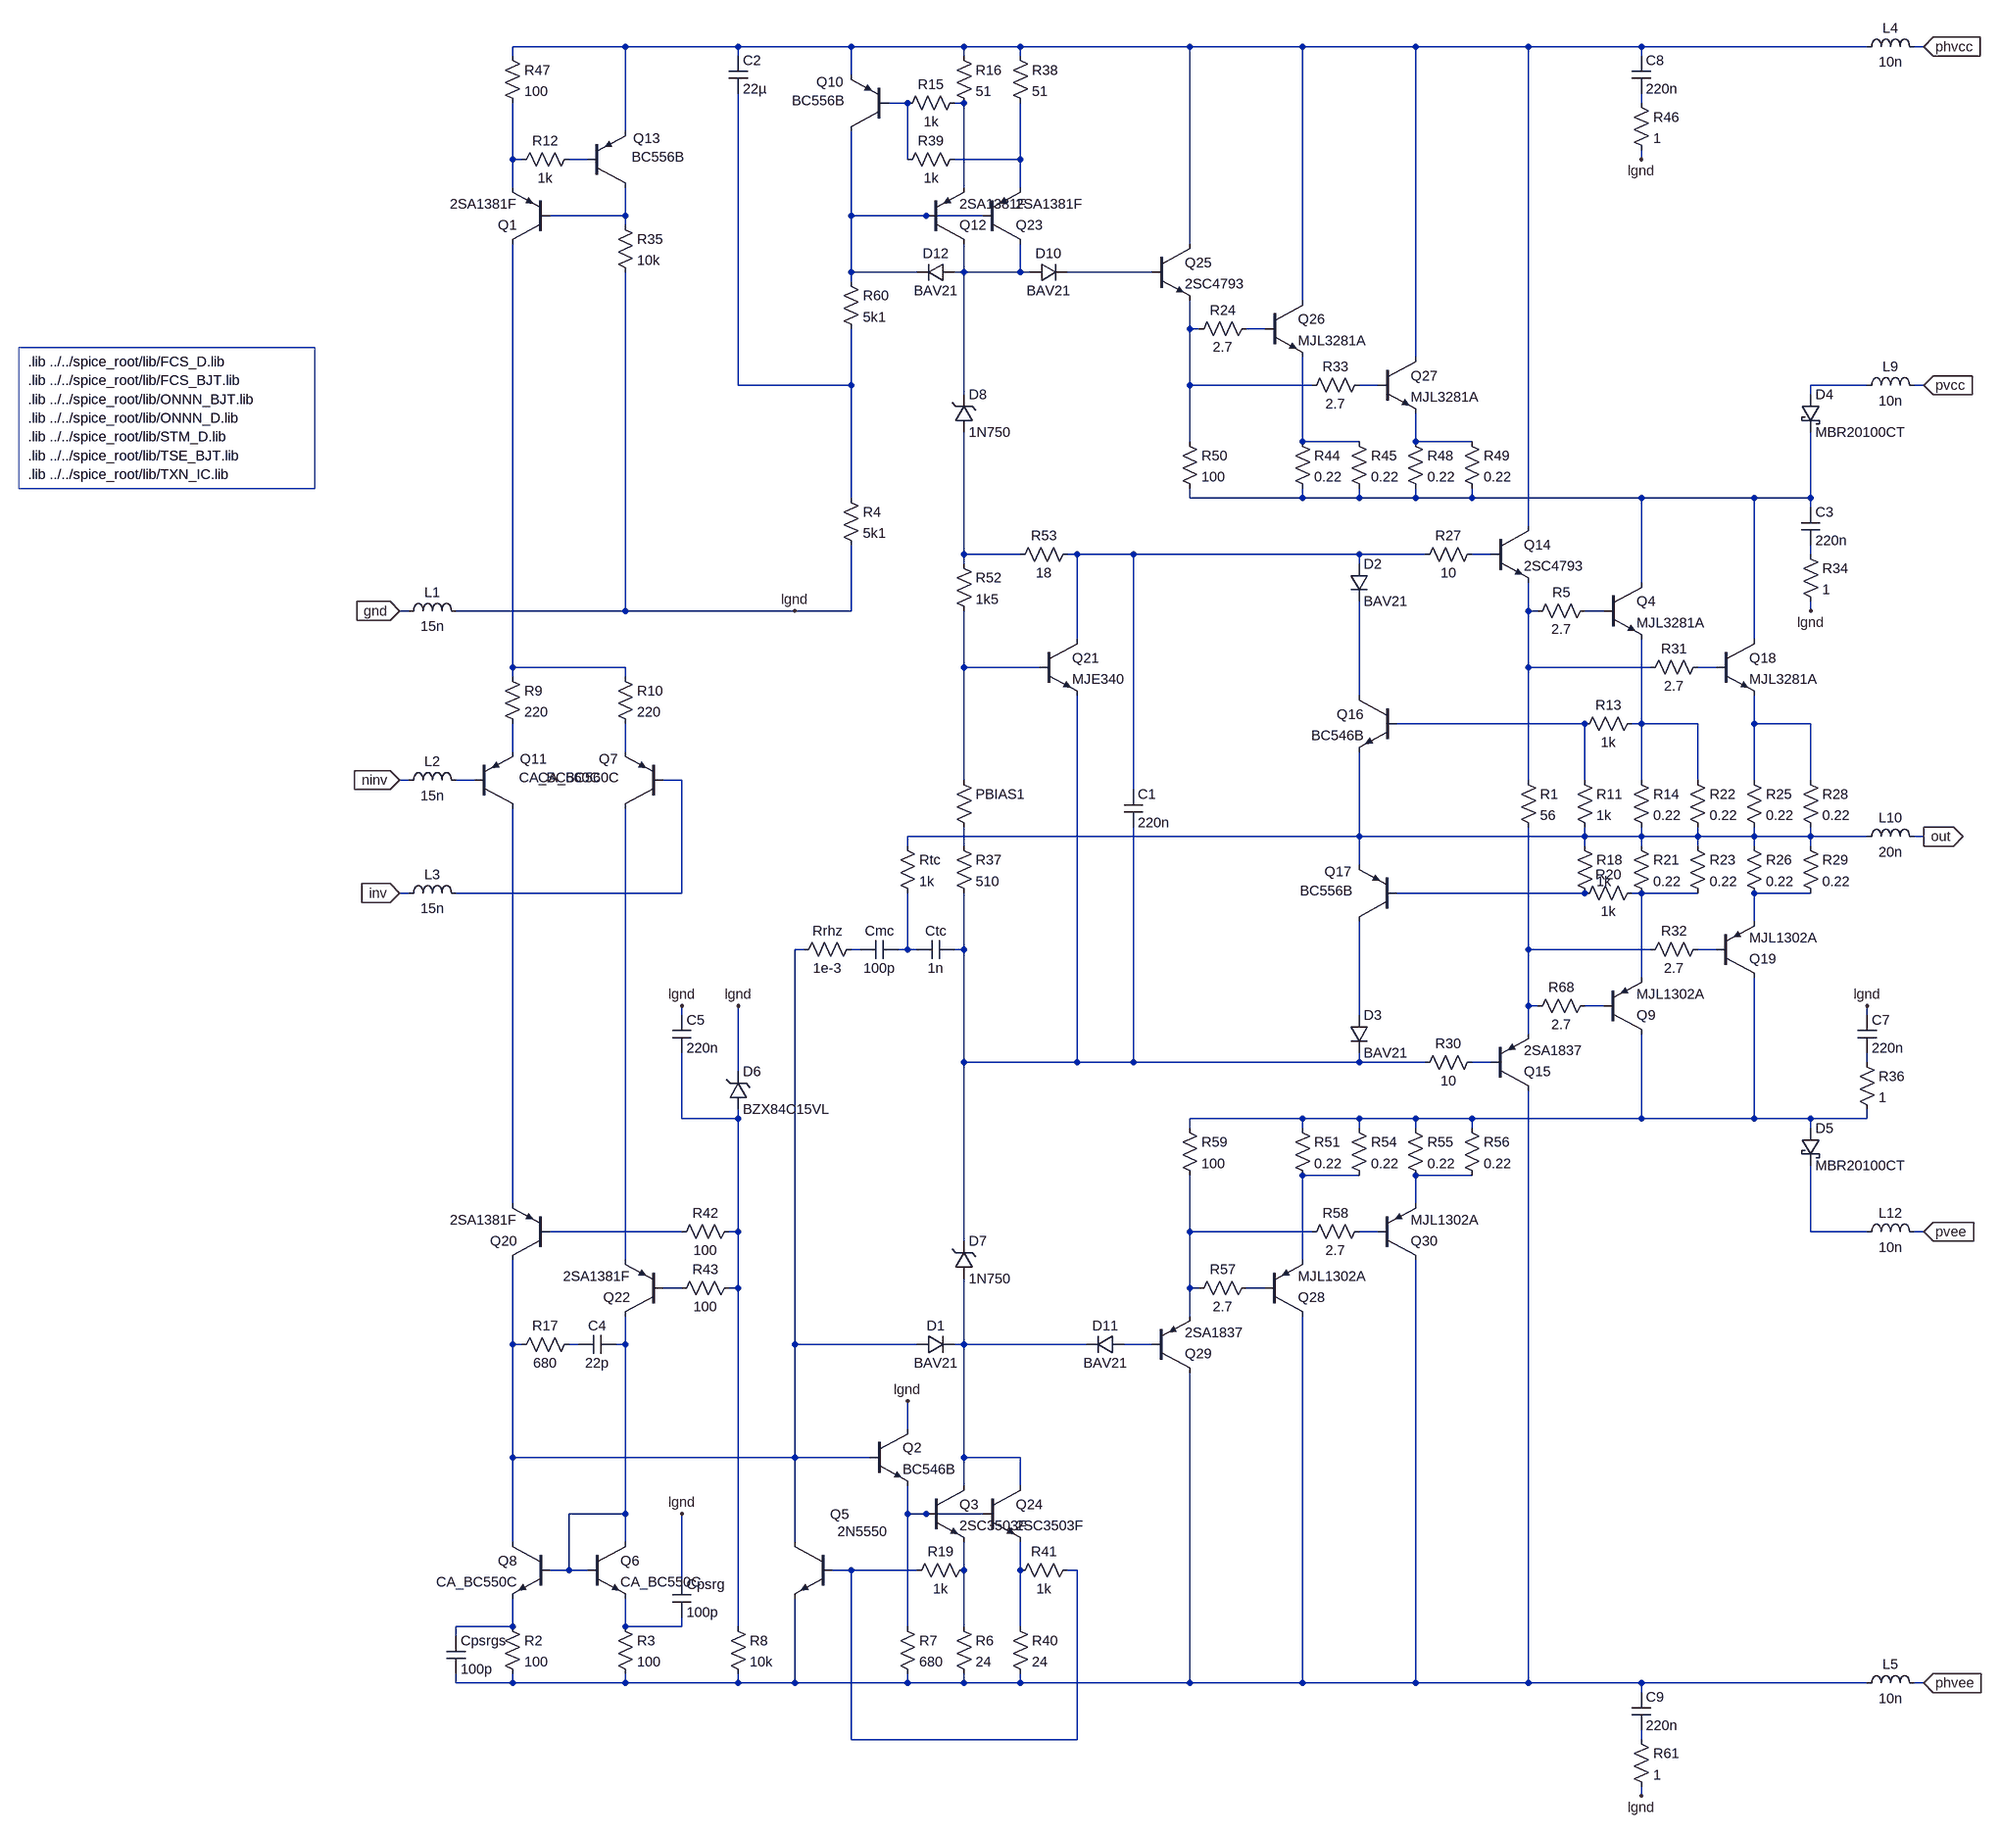
[diagram p0: schematic pab3bbb-arguo-module-hpw.asc]
pab3bbb-arguo-module-hpw.asc, the LTspice schematic file:
Version 4
SHEET 1 6124 2336
WIRE 192 -1568 0 -1568
WIRE 384 -1568 192 -1568
WIRE 576 -1568 384 -1568
WIRE 768 -1568 576 -1568
WIRE 864 -1568 768 -1568
WIRE 1152 -1568 864 -1568
WIRE 1344 -1568 1152 -1568
WIRE 1536 -1568 1344 -1568
WIRE 1728 -1568 1536 -1568
WIRE 1920 -1568 1728 -1568
WIRE 2304 -1568 1920 -1568
WIRE 2400 -1568 2384 -1568
WIRE 0 -1552 0 -1568
WIRE 384 -1552 384 -1568
WIRE 768 -1552 768 -1568
WIRE 864 -1552 864 -1568
WIRE 1920 -1552 1920 -1568
WIRE 576 -1520 576 -1568
WIRE 672 -1472 640 -1472
WIRE 768 -1472 752 -1472
WIRE 1920 -1472 1920 -1488
WIRE 192 -1424 192 -1568
WIRE 0 -1376 0 -1472
WIRE 16 -1376 0 -1376
WIRE 128 -1376 96 -1376
WIRE 672 -1376 672 -1472
WIRE 864 -1376 864 -1472
WIRE 864 -1376 752 -1376
WIRE 1920 -1376 1920 -1392
WIRE 0 -1328 0 -1376
WIRE 768 -1328 768 -1472
WIRE 864 -1328 864 -1376
WIRE 192 -1280 192 -1328
WIRE 192 -1280 64 -1280
WIRE 576 -1280 576 -1424
WIRE 704 -1280 576 -1280
WIRE 800 -1280 704 -1280
WIRE 192 -1264 192 -1280
WIRE 1152 -1232 1152 -1568
WIRE 576 -1184 576 -1280
WIRE 688 -1184 576 -1184
WIRE 768 -1184 768 -1232
WIRE 768 -1184 752 -1184
WIRE 864 -1184 864 -1232
WIRE 864 -1184 768 -1184
WIRE 880 -1184 864 -1184
WIRE 1088 -1184 944 -1184
WIRE 576 -1168 576 -1184
WIRE 1344 -1136 1344 -1568
WIRE 1152 -1088 1152 -1136
WIRE 1168 -1088 1152 -1088
WIRE 1280 -1088 1248 -1088
WIRE 1536 -1040 1536 -1568
WIRE 384 -992 384 -1488
WIRE 576 -992 576 -1088
WIRE 576 -992 384 -992
WIRE 1152 -992 1152 -1088
WIRE 1360 -992 1152 -992
WIRE 1472 -992 1440 -992
WIRE 2304 -992 2208 -992
WIRE 2400 -992 2384 -992
WIRE 768 -976 768 -1184
WIRE 2208 -976 2208 -992
WIRE 1152 -896 1152 -992
WIRE 1344 -896 1344 -1040
WIRE 1440 -896 1344 -896
WIRE 1536 -896 1536 -944
WIRE 1632 -896 1536 -896
WIRE 576 -800 576 -992
WIRE 1152 -800 1152 -816
WIRE 1344 -800 1344 -816
WIRE 1344 -800 1152 -800
WIRE 1440 -800 1440 -816
WIRE 1440 -800 1344 -800
WIRE 1536 -800 1536 -816
WIRE 1536 -800 1440 -800
WIRE 1632 -800 1632 -816
WIRE 1632 -800 1536 -800
WIRE 1920 -800 1632 -800
WIRE 2112 -800 1920 -800
WIRE 2208 -800 2208 -912
WIRE 2208 -800 2112 -800
WIRE 2208 -784 2208 -800
WIRE 1728 -752 1728 -1568
WIRE 768 -704 768 -912
WIRE 864 -704 768 -704
WIRE 960 -704 944 -704
WIRE 1056 -704 960 -704
WIRE 1440 -704 1056 -704
WIRE 1552 -704 1440 -704
WIRE 1664 -704 1632 -704
WIRE 2208 -704 2208 -720
WIRE 768 -688 768 -704
WIRE 1440 -688 1440 -704
WIRE 1920 -656 1920 -800
WIRE -176 -608 -192 -608
WIRE 192 -608 192 -1184
WIRE 192 -608 -96 -608
WIRE 480 -608 192 -608
WIRE 576 -608 576 -720
WIRE 576 -608 480 -608
WIRE 1728 -608 1728 -656
WIRE 1744 -608 1728 -608
WIRE 1856 -608 1824 -608
WIRE 2208 -608 2208 -624
WIRE 960 -560 960 -704
WIRE 2112 -560 2112 -800
WIRE 0 -512 0 -1232
WIRE 192 -512 0 -512
WIRE 768 -512 768 -608
WIRE 896 -512 768 -512
WIRE 1728 -512 1728 -608
WIRE 1936 -512 1728 -512
WIRE 2048 -512 2016 -512
WIRE 0 -496 0 -512
WIRE 192 -496 192 -512
WIRE 1440 -464 1440 -624
WIRE 1824 -416 1504 -416
WIRE 1920 -416 1920 -560
WIRE 1920 -416 1904 -416
WIRE 2016 -416 1920 -416
WIRE 2112 -416 2112 -464
WIRE 2208 -416 2112 -416
WIRE 0 -368 0 -416
WIRE 192 -368 192 -416
WIRE -176 -320 -192 -320
WIRE -64 -320 -96 -320
WIRE 288 -320 256 -320
WIRE 768 -320 768 -512
WIRE 1728 -320 1728 -512
WIRE 1824 -320 1824 -416
WIRE 1920 -320 1920 -416
WIRE 2016 -320 2016 -416
WIRE 2112 -320 2112 -416
WIRE 2208 -320 2208 -416
WIRE 1056 -304 1056 -704
WIRE 1440 -224 1440 -368
WIRE 1440 -224 672 -224
WIRE 1824 -224 1824 -240
WIRE 1824 -224 1440 -224
WIRE 1920 -224 1920 -240
WIRE 1920 -224 1824 -224
WIRE 2016 -224 2016 -240
WIRE 2016 -224 1920 -224
WIRE 2112 -224 2112 -240
WIRE 2112 -224 2016 -224
WIRE 2208 -224 2208 -240
WIRE 2208 -224 2112 -224
WIRE 2304 -224 2208 -224
WIRE 2400 -224 2384 -224
WIRE 672 -208 672 -224
WIRE 768 -208 768 -240
WIRE 1824 -208 1824 -224
WIRE 1920 -208 1920 -224
WIRE 2016 -208 2016 -224
WIRE 2112 -208 2112 -224
WIRE 2208 -208 2208 -224
WIRE 1440 -176 1440 -224
WIRE -176 -128 -192 -128
WIRE 288 -128 288 -320
WIRE 288 -128 -96 -128
WIRE 1824 -128 1504 -128
WIRE 1920 -128 1904 -128
WIRE 2016 -128 1920 -128
WIRE 2208 -128 2112 -128
WIRE 2112 -80 2112 -128
WIRE 496 -32 480 -32
WIRE 592 -32 576 -32
WIRE 672 -32 672 -128
WIRE 672 -32 656 -32
WIRE 688 -32 672 -32
WIRE 768 -32 768 -128
WIRE 768 -32 752 -32
WIRE 1728 -32 1728 -240
WIRE 1936 -32 1728 -32
WIRE 2048 -32 2016 -32
WIRE 1920 16 1920 -128
WIRE 1728 64 1728 -32
WIRE 1744 64 1728 64
WIRE 1856 64 1824 64
WIRE 288 80 288 64
WIRE 1440 80 1440 -80
WIRE 2304 80 2304 64
WIRE 1728 112 1728 64
WIRE 768 160 768 -32
WIRE 960 160 960 -464
WIRE 960 160 768 160
WIRE 1056 160 1056 -240
WIRE 1056 160 960 160
WIRE 1440 160 1440 144
WIRE 1440 160 1056 160
WIRE 1552 160 1440 160
WIRE 1664 160 1632 160
WIRE 2304 160 2304 144
WIRE 384 176 384 64
WIRE 288 256 288 144
WIRE 384 256 384 240
WIRE 384 256 288 256
WIRE 1344 256 1152 256
WIRE 1440 256 1344 256
WIRE 1536 256 1440 256
WIRE 1632 256 1536 256
WIRE 1920 256 1920 112
WIRE 1920 256 1632 256
WIRE 2112 256 2112 16
WIRE 2112 256 1920 256
WIRE 2208 256 2112 256
WIRE 2304 256 2304 240
WIRE 2304 256 2208 256
WIRE 1152 272 1152 256
WIRE 1344 272 1344 256
WIRE 1440 272 1440 256
WIRE 1536 272 1536 256
WIRE 1632 272 1632 256
WIRE 2208 272 2208 256
WIRE 1440 352 1344 352
WIRE 1632 352 1536 352
WIRE 0 400 0 -272
WIRE 1536 400 1536 352
WIRE 288 448 64 448
WIRE 384 448 384 256
WIRE 384 448 368 448
WIRE 1152 448 1152 352
WIRE 1360 448 1152 448
WIRE 1472 448 1440 448
WIRE 2208 448 2208 336
WIRE 2304 448 2208 448
WIRE 2400 448 2384 448
WIRE 768 464 768 160
WIRE 192 496 192 -272
WIRE 1344 496 1344 352
WIRE 288 544 256 544
WIRE 384 544 384 448
WIRE 384 544 368 544
WIRE 1152 544 1152 448
WIRE 1168 544 1152 544
WIRE 1280 544 1248 544
WIRE 1152 592 1152 544
WIRE 0 640 0 496
WIRE 16 640 0 640
WIRE 112 640 96 640
WIRE 192 640 192 592
WIRE 192 640 176 640
WIRE 480 640 480 -32
WIRE 688 640 480 640
WIRE 768 640 768 528
WIRE 768 640 752 640
WIRE 976 640 768 640
WIRE 1088 640 1040 640
WIRE 672 784 672 736
WIRE 0 832 0 640
WIRE 480 832 480 640
WIRE 480 832 0 832
WIRE 608 832 480 832
WIRE 768 832 768 640
WIRE 864 832 768 832
WIRE 768 880 768 832
WIRE 864 880 864 832
WIRE 192 928 192 640
WIRE 192 928 96 928
WIRE 672 928 672 880
WIRE 704 928 672 928
WIRE 800 928 704 928
WIRE 0 976 0 832
WIRE 192 976 192 928
WIRE 480 976 480 832
WIRE 96 1024 96 928
WIRE 96 1024 64 1024
WIRE 128 1024 96 1024
WIRE 576 1024 544 1024
WIRE 688 1024 576 1024
WIRE 768 1024 768 976
WIRE 864 1024 864 976
WIRE 960 1024 944 1024
WIRE 288 1040 288 928
WIRE 0 1120 0 1072
WIRE 0 1120 -96 1120
WIRE 192 1120 192 1072
WIRE 288 1120 288 1104
WIRE 288 1120 192 1120
WIRE 384 1120 384 544
WIRE 672 1120 672 928
WIRE 768 1120 768 1024
WIRE 864 1120 864 1024
WIRE -96 1136 -96 1120
WIRE -96 1216 -96 1200
WIRE 0 1216 0 1200
WIRE 0 1216 -96 1216
WIRE 192 1216 192 1200
WIRE 192 1216 0 1216
WIRE 384 1216 384 1200
WIRE 384 1216 192 1216
WIRE 480 1216 480 1072
WIRE 480 1216 384 1216
WIRE 672 1216 672 1200
WIRE 672 1216 480 1216
WIRE 768 1216 768 1200
WIRE 768 1216 672 1216
WIRE 864 1216 864 1200
WIRE 864 1216 768 1216
WIRE 1152 1216 1152 688
WIRE 1152 1216 864 1216
WIRE 1344 1216 1344 592
WIRE 1344 1216 1152 1216
WIRE 1536 1216 1536 496
WIRE 1536 1216 1344 1216
WIRE 1728 1216 1728 208
WIRE 1728 1216 1536 1216
WIRE 1920 1216 1728 1216
WIRE 2304 1216 1920 1216
WIRE 2400 1216 2384 1216
WIRE 1920 1232 1920 1216
WIRE 576 1312 576 1024
WIRE 960 1312 960 1024
WIRE 960 1312 576 1312
WIRE 1920 1312 1920 1296
WIRE 1920 1408 1920 1392
FLAG 2400 -992 pvcc
IOPIN 2400 -992 In
FLAG 2400 448 pvee
IOPIN 2400 448 In
FLAG 2400 -224 out
IOPIN 2400 -224 Out
FLAG -192 -320 ninv
IOPIN -192 -320 In
FLAG -192 -128 inv
IOPIN -192 -128 In
FLAG -192 -608 gnd
IOPIN -192 -608 In
FLAG 2400 -1568 phvcc
IOPIN 2400 -1568 In
FLAG 480 -608 lgnd
FLAG 2304 64 lgnd
FLAG 2208 -608 lgnd
FLAG 288 928 lgnd
FLAG 672 736 lgnd
FLAG 384 64 lgnd
FLAG 288 64 lgnd
FLAG 1920 -1376 lgnd
FLAG 1920 1408 lgnd
FLAG 2400 1216 phvee
IOPIN 2400 1216 In
SYMBOL pnp -64 -272 M180
WINDOW 0 77 84 Left 2
WINDOW 3 75 52 Left 2
SYMATTR InstName Q11
SYMATTR Value CA_BC560C
SYMBOL res -16 1104 R0
SYMATTR InstName R2
SYMATTR Value 100
SYMBOL res 176 1104 R0
SYMATTR InstName R3
SYMATTR Value 100
SYMBOL res -16 -512 R0
SYMATTR InstName R9
SYMATTR Value 220
SYMBOL res 176 -512 R0
SYMATTR InstName R10
SYMATTR Value 220
SYMBOL res 752 -1568 R0
SYMATTR InstName R16
SYMATTR Value 51
SYMBOL pnp 704 -1232 M180
SYMATTR InstName Q12
SYMATTR Value 2SA1381F
SYMBOL res 1648 -720 R90
WINDOW 0 0 56 VBottom 2
WINDOW 3 32 56 VTop 2
SYMATTR InstName R27
SYMATTR Value 10
SYMBOL res 1648 144 R90
WINDOW 0 0 56 VBottom 2
WINDOW 3 32 56 VTop 2
SYMATTR InstName R30
SYMATTR Value 10
SYMBOL res -16 -1568 R0
SYMATTR InstName R47
SYMATTR Value 100
SYMBOL res 752 -336 R0
WINDOW 3 36 76 Invisible 2
SYMATTR Value {1+(500*BIAS)}
SYMATTR InstName PBIAS1
SYMBOL res 752 -704 R0
SYMATTR InstName R52
SYMATTR Value 1k5
SYMBOL res 960 -720 R90
WINDOW 0 0 56 VBottom 2
WINDOW 3 32 56 VTop 2
SYMATTR InstName R53
SYMATTR Value 18
SYMBOL npn 704 880 R0
SYMATTR InstName Q3
SYMATTR Value 2SC3503F
SYMBOL res 752 1104 R0
SYMATTR InstName R6
SYMATTR Value 24
SYMBOL res 560 -816 R0
SYMATTR InstName R4
SYMATTR Value 5k1
SYMBOL pnp 64 -1232 R180
SYMATTR InstName Q1
SYMATTR Value 2SA1381F
SYMBOL pnp 256 -272 R180
WINDOW 0 77 84 Left 2
WINDOW 3 75 52 Left 2
SYMATTR InstName Q7
SYMATTR Value CA_BC560C
SYMBOL npn 896 -560 R0
SYMATTR InstName Q21
SYMATTR Value MJE340
SYMBOL res 752 -224 R0
SYMATTR InstName R37
SYMATTR Value 510
SYMBOL npn 1856 -656 R0
SYMATTR InstName Q4
SYMATTR Value MJL3281A
SYMBOL pnp 1856 112 M180
SYMATTR InstName Q9
SYMATTR Value MJL1302A
SYMBOL res 1840 -624 R90
WINDOW 0 0 56 VBottom 2
WINDOW 3 32 56 VTop 2
SYMATTR InstName R5
SYMATTR Value 2.7
SYMBOL res 1840 48 R90
WINDOW 0 0 56 VBottom 2
WINDOW 3 32 56 VTop 2
SYMATTR InstName R68
SYMATTR Value 2.7
SYMBOL cap 656 -48 R90
WINDOW 0 0 32 VBottom 2
WINDOW 3 32 32 VTop 2
SYMATTR InstName Cmc
SYMATTR Value 100p
SYMATTR SpiceLine V=100 Irms=20.8m Rser=5.448 Lser=3n Rpar=6.4meg Cpar=1p
SYMBOL npn 128 976 R0
SYMATTR InstName Q6
SYMATTR Value CA_BC550C
SYMBOL npn 64 976 M0
SYMATTR InstName Q8
SYMATTR Value CA_BC550C
SYMBOL res 768 -1488 R90
WINDOW 0 0 56 VBottom 2
WINDOW 3 32 56 VTop 2
SYMATTR InstName R15
SYMATTR Value 1k
SYMBOL npn 608 784 R0
SYMATTR InstName Q2
SYMATTR Value BC546B
SYMBOL res 656 1104 R0
SYMATTR InstName R7
SYMATTR Value 680
SYMBOL cap 752 -48 R90
WINDOW 0 0 32 VBottom 2
WINDOW 3 32 32 VTop 2
SYMATTR InstName Ctc
SYMATTR Value 1n
SYMATTR SpiceLine V=100 Irms=75.3m Rser=2.89088 Lser=3n Rpar=4.4meg Cpar=1p
SYMBOL res 656 -224 R0
SYMATTR InstName Rtc
SYMATTR Value 1k
SYMBOL diode 688 656 R270
WINDOW 0 32 32 VTop 2
WINDOW 3 0 32 VBottom 2
SYMATTR InstName D1
SYMATTR Value BAV21
SYMBOL pnp 640 -1424 R180
WINDOW 0 77 84 Left 2
WINDOW 3 75 52 Left 2
SYMATTR InstName Q10
SYMATTR Value BC556B
SYMBOL res 1904 -336 R0
SYMATTR InstName R14
SYMATTR Value 0.22
SYMBOL res 1904 -224 R0
SYMATTR InstName R21
SYMATTR Value 0.22
SYMBOL res 176 -1280 R0
SYMATTR InstName R35
SYMATTR Value 10k
SYMBOL cap 1040 -240 M180
WINDOW 0 24 56 Left 2
WINDOW 3 24 8 Left 2
SYMATTR InstName C1
SYMATTR Value 220n
SYMATTR SpiceLine V=25 Irms=1.76 Rser=0.057522 Lser=3n Rpar=4.4meg Cpar=1p
SYMBOL ind -192 -592 R270
WINDOW 0 32 56 VTop 2
WINDOW 3 5 56 VBottom 2
SYMATTR InstName L1
SYMATTR Value 15n
SYMATTR SpiceLine Rser=20m
SYMBOL ind -192 -304 R270
WINDOW 0 32 56 VTop 2
WINDOW 3 5 56 VBottom 2
SYMATTR InstName L2
SYMATTR Value 15n
SYMATTR SpiceLine Rser=20m
SYMBOL ind -192 -112 R270
WINDOW 0 32 56 VTop 2
WINDOW 3 5 56 VBottom 2
SYMATTR InstName L3
SYMATTR Value 15n
SYMATTR SpiceLine Rser=20m
SYMBOL ind 2288 -208 R270
WINDOW 0 32 56 VTop 2
WINDOW 3 5 56 VBottom 2
SYMATTR InstName L10
SYMATTR Value 20n
SYMATTR SpiceLine Rser=10m
SYMBOL ind 2288 -976 R270
WINDOW 0 32 56 VTop 2
WINDOW 3 5 56 VBottom 2
SYMATTR InstName L9
SYMATTR Value 10n
SYMATTR SpiceLine Rser=10m
SYMBOL ind 2288 464 R270
WINDOW 0 32 56 VTop 2
WINDOW 3 5 56 VBottom 2
SYMATTR InstName L12
SYMATTR Value 10n
SYMATTR SpiceLine Rser=10m
SYMBOL cap 112 656 R270
WINDOW 0 32 32 VTop 2
WINDOW 3 0 32 VBottom 2
SYMATTR InstName C4
SYMATTR Value 22p
SYMATTR SpiceLine V=100 Irms=20.8m Rser=15.448 Lser=3n Rpar=6.4meg Cpar=1p
SYMBOL res 112 624 R90
WINDOW 0 0 56 VBottom 2
WINDOW 3 32 56 VTop 2
SYMATTR InstName R17
SYMATTR Value 680
SYMBOL pnp 128 -1328 M180
WINDOW 0 77 84 Left 2
WINDOW 3 75 52 Left 2
SYMATTR InstName Q13
SYMATTR Value BC556B
SYMBOL res 112 -1392 R90
WINDOW 0 0 56 VBottom 2
WINDOW 3 32 56 VTop 2
SYMATTR InstName R12
SYMATTR Value 1k
SYMBOL npn 1664 -752 R0
SYMATTR InstName Q14
SYMATTR Value 2SC4793
SYMBOL pnp 1664 208 M180
SYMATTR InstName Q15
SYMATTR Value 2SA1837
SYMBOL res 1712 -336 R0
SYMATTR InstName R1
SYMATTR Value 56
SYMBOL npn 544 976 M0
WINDOW 0 -29 -47 Left 2
WINDOW 3 -94 -18 Left 2
SYMATTR InstName Q5
SYMATTR Value 2N5550
SYMBOL res 784 1008 R90
WINDOW 0 0 56 VBottom 2
WINDOW 3 32 56 VTop 2
SYMATTR InstName R19
SYMATTR Value 1k
SYMBOL cap -112 1136 R0
SYMATTR InstName Cpsrgs
SYMATTR Value 100p
SYMATTR SpiceLine V=100 Irms=20.8m Rser=5.448 Lser=3n Rpar=6.4meg Cpar=1p
SYMBOL cap 272 1040 R0
SYMATTR InstName Cpsrg
SYMATTR Value 100p
SYMATTR SpiceLine V=100 Irms=20.8m Rser=5.448 Lser=3n Rpar=6.4meg Cpar=1p
SYMBOL npn 1504 -464 M0
SYMATTR InstName Q16
SYMATTR Value BC546B
SYMBOL diode 1424 -688 R0
SYMATTR InstName D2
SYMATTR Value BAV21
SYMBOL res 1808 -336 R0
SYMATTR InstName R11
SYMATTR Value 1k
SYMBOL res 1920 -432 R90
WINDOW 0 0 56 VBottom 2
WINDOW 3 32 56 VTop 2
SYMATTR InstName R13
SYMATTR Value 1k
SYMBOL pnp 1504 -80 R180
WINDOW 0 77 84 Left 2
WINDOW 3 75 52 Left 2
SYMATTR InstName Q17
SYMATTR Value BC556B
SYMBOL res 1808 -224 R0
SYMATTR InstName R18
SYMATTR Value 1k
SYMBOL res 1920 -144 R90
WINDOW 0 0 56 VBottom 2
WINDOW 3 32 56 VTop 2
SYMATTR InstName R20
SYMATTR Value 1k
SYMBOL diode 1424 80 R0
SYMATTR InstName D3
SYMATTR Value BAV21
SYMBOL res 2000 -336 R0
SYMATTR InstName R22
SYMATTR Value 0.22
SYMBOL res 2000 -224 R0
SYMATTR InstName R23
SYMATTR Value 0.22
SYMBOL res 592 -48 R90
WINDOW 0 0 56 VBottom 2
WINDOW 3 32 56 VTop 2
SYMATTR InstName Rrhz
SYMATTR Value 1e-3
SYMBOL res 2096 -336 R0
SYMATTR InstName R25
SYMATTR Value 0.22
SYMBOL res 2096 -224 R0
SYMATTR InstName R26
SYMATTR Value 0.22
SYMBOL res 2192 -336 R0
SYMATTR InstName R28
SYMATTR Value 0.22
SYMBOL res 2192 -224 R0
SYMATTR InstName R29
SYMATTR Value 0.22
SYMBOL npn 2048 -560 R0
SYMATTR InstName Q18
SYMATTR Value MJL3281A
SYMBOL res 2032 -528 R90
WINDOW 0 0 56 VBottom 2
WINDOW 3 32 56 VTop 2
SYMATTR InstName R31
SYMATTR Value 2.7
SYMBOL pnp 2048 16 M180
SYMATTR InstName Q19
SYMATTR Value MJL1302A
SYMBOL res 2032 -48 R90
WINDOW 0 0 56 VBottom 2
WINDOW 3 32 56 VTop 2
SYMATTR InstName R32
SYMATTR Value 2.7
SYMBOL ind 2288 -1552 R270
WINDOW 0 32 56 VTop 2
WINDOW 3 5 56 VBottom 2
SYMATTR InstName L4
SYMATTR Value 10n
SYMATTR SpiceLine Rser=10m
SYMBOL schottky 2192 -976 R0
SYMATTR InstName D4
SYMATTR Value MBR20100CT
SYMATTR Description Diode
SYMATTR Type diode
SYMBOL res 2192 -720 R0
SYMATTR InstName R34
SYMATTR Value 1
SYMBOL cap 2192 -720 M180
WINDOW 0 24 56 Left 2
WINDOW 3 24 8 Left 2
SYMATTR InstName C3
SYMATTR Value 220n
SYMATTR SpiceLine V=25 Irms=1.76 Rser=0.057522 Lser=3n Rpar=4.4meg Cpar=1p
SYMBOL schottky 2192 272 R0
SYMATTR InstName D5
SYMATTR Value MBR20100CT
SYMATTR Description Diode
SYMATTR Type diode
SYMBOL res 2288 144 R0
SYMATTR InstName R36
SYMATTR Value 1
SYMBOL cap 2288 144 M180
WINDOW 0 24 56 Left 2
WINDOW 3 24 8 Left 2
SYMATTR InstName C7
SYMATTR Value 220n
SYMATTR SpiceLine V=25 Irms=1.76 Rser=0.057522 Lser=3n Rpar=4.4meg Cpar=1p
SYMBOL pnp 64 496 R180
SYMATTR InstName Q20
SYMATTR Value 2SA1381F
SYMBOL pnp 256 592 R180
SYMATTR InstName Q22
SYMATTR Value 2SA1381F
SYMBOL zener 368 240 M180
WINDOW 0 24 64 Left 2
WINDOW 3 24 0 Left 2
SYMATTR InstName D6
SYMATTR Value BZX84C15VL
SYMATTR Description Diode
SYMATTR Type diode
SYMBOL res 368 1104 R0
SYMATTR InstName R8
SYMATTR Value 10k
SYMBOL res 848 -1568 R0
SYMATTR InstName R38
SYMATTR Value 51
SYMBOL pnp 800 -1232 M180
SYMATTR InstName Q23
SYMATTR Value 2SA1381F
SYMBOL res 768 -1392 R90
WINDOW 0 0 56 VBottom 2
WINDOW 3 32 56 VTop 2
SYMATTR InstName R39
SYMATTR Value 1k
SYMBOL npn 800 880 R0
SYMATTR InstName Q24
SYMATTR Value 2SC3503F
SYMBOL res 848 1104 R0
SYMATTR InstName R40
SYMATTR Value 24
SYMBOL res 960 1008 R90
WINDOW 0 0 56 VBottom 2
WINDOW 3 32 56 VTop 2
SYMATTR InstName R41
SYMATTR Value 1k
SYMBOL cap 272 144 M180
WINDOW 0 24 56 Left 2
WINDOW 3 24 8 Left 2
SYMATTR InstName C5
SYMATTR Value 220n
SYMATTR SpiceLine V=25 Irms=1.76 Rser=0.057522 Lser=3n Rpar=4.4meg Cpar=1p
SYMBOL res 384 432 R90
WINDOW 0 0 56 VBottom 2
WINDOW 3 32 56 VTop 2
SYMATTR InstName R42
SYMATTR Value 100
SYMBOL res 384 528 R90
WINDOW 0 0 56 VBottom 2
WINDOW 3 32 56 VTop 2
SYMATTR InstName R43
SYMATTR Value 100
SYMBOL res 1904 -1488 R0
SYMATTR InstName R46
SYMATTR Value 1
SYMBOL cap 1904 -1488 M180
WINDOW 0 24 56 Left 2
WINDOW 3 24 8 Left 2
SYMATTR InstName C8
SYMATTR Value 220n
SYMATTR SpiceLine V=25 Irms=1.76 Rser=0.057522 Lser=3n Rpar=4.4meg Cpar=1p
SYMBOL res 1904 1296 R0
SYMATTR InstName R61
SYMATTR Value 1
SYMBOL cap 1904 1296 M180
WINDOW 0 24 56 Left 2
WINDOW 3 24 8 Left 2
SYMATTR InstName C9
SYMATTR Value 220n
SYMATTR SpiceLine V=25 Irms=1.76 Rser=0.057522 Lser=3n Rpar=4.4meg Cpar=1p
SYMBOL ind 2288 1232 R270
WINDOW 0 32 56 VTop 2
WINDOW 3 5 56 VBottom 2
SYMATTR InstName L5
SYMATTR Value 10n
SYMATTR SpiceLine Rser=10m
SYMBOL zener 752 -912 M180
WINDOW 0 24 64 Left 2
WINDOW 3 24 0 Left 2
SYMATTR InstName D8
SYMATTR Value 1N750
SYMATTR Description Diode
SYMATTR Type diode
SYMBOL zener 752 528 M180
WINDOW 0 24 64 Left 2
WINDOW 3 24 0 Left 2
SYMATTR InstName D7
SYMATTR Value 1N750
SYMATTR Description Diode
SYMATTR Type diode
SYMBOL npn 1088 -1232 R0
SYMATTR InstName Q25
SYMATTR Value 2SC4793
SYMBOL npn 1280 -1136 R0
SYMATTR InstName Q26
SYMATTR Value MJL3281A
SYMBOL res 1264 -1104 R90
WINDOW 0 0 56 VBottom 2
WINDOW 3 32 56 VTop 2
SYMATTR InstName R24
SYMATTR Value 2.7
SYMBOL npn 1472 -1040 R0
SYMATTR InstName Q27
SYMATTR Value MJL3281A
SYMBOL res 1456 -1008 R90
WINDOW 0 0 56 VBottom 2
WINDOW 3 32 56 VTop 2
SYMATTR InstName R33
SYMATTR Value 2.7
SYMBOL res 1328 -912 R0
SYMATTR InstName R44
SYMATTR Value 0.22
SYMBOL res 1424 -912 R0
SYMATTR InstName R45
SYMATTR Value 0.22
SYMBOL res 1520 -912 R0
SYMATTR InstName R48
SYMATTR Value 0.22
SYMBOL res 1616 -912 R0
SYMATTR InstName R49
SYMATTR Value 0.22
SYMBOL res 1136 -912 R0
SYMATTR InstName R50
SYMATTR Value 100
SYMBOL res 1328 256 R0
SYMATTR InstName R51
SYMATTR Value 0.22
SYMBOL res 1424 256 R0
SYMATTR InstName R54
SYMATTR Value 0.22
SYMBOL res 1520 256 R0
SYMATTR InstName R55
SYMATTR Value 0.22
SYMBOL res 1616 256 R0
SYMATTR InstName R56
SYMATTR Value 0.22
SYMBOL pnp 1280 592 M180
SYMATTR InstName Q28
SYMATTR Value MJL1302A
SYMBOL res 1264 528 R90
WINDOW 0 0 56 VBottom 2
WINDOW 3 32 56 VTop 2
SYMATTR InstName R57
SYMATTR Value 2.7
SYMBOL pnp 1088 688 M180
SYMATTR InstName Q29
SYMATTR Value 2SA1837
SYMBOL pnp 1472 496 M180
SYMATTR InstName Q30
SYMATTR Value MJL1302A
SYMBOL res 1456 432 R90
WINDOW 0 0 56 VBottom 2
WINDOW 3 32 56 VTop 2
SYMATTR InstName R58
SYMATTR Value 2.7
SYMBOL diode 880 -1168 R270
WINDOW 0 32 32 VTop 2
WINDOW 3 0 32 VBottom 2
SYMATTR InstName D10
SYMATTR Value BAV21
SYMBOL diode 1040 624 R90
WINDOW 0 0 32 VBottom 2
WINDOW 3 32 32 VTop 2
SYMATTR InstName D11
SYMATTR Value BAV21
SYMBOL res 1136 256 R0
SYMATTR InstName R59
SYMATTR Value 100
SYMBOL diode 752 -1200 R90
WINDOW 0 0 32 VBottom 2
WINDOW 3 32 32 VTop 2
SYMATTR InstName D12
SYMATTR Value BAV21
SYMBOL res 560 -1184 R0
SYMATTR InstName R60
SYMATTR Value 5k1
SYMBOL cap 368 -1488 M180
WINDOW 0 24 56 Left 2
WINDOW 3 24 8 Left 2
SYMATTR InstName C2
SYMATTR Value 22µ
SYMATTR SpiceLine V=25 Irms=1.76 Rser=0.057522 Lser=3n Rpar=4.4meg Cpar=1p
TEXT -992 -968 Left 2 !.lib ../../spice_root/lib/ONNN_BJT.lib
TEXT -992 -904 Left 2 !.lib ../../spice_root/lib/STM_D.lib
TEXT -992 -1000 Left 2 !.lib ../../spice_root/lib/FCS_BJT.lib
TEXT -992 -1032 Left 2 !.lib ../../spice_root/lib/FCS_D.lib
TEXT -992 -936 Left 2 !.lib ../../spice_root/lib/ONNN_D.lib
TEXT -992 -872 Left 2 !.lib ../../spice_root/lib/TSE_BJT.lib
TEXT -992 -840 Left 2 !.lib ../../spice_root/lib/TXN_IC.lib
RECTANGLE Normal -336 -816 -1008 -1056

The netlist it stands for:
* pab3bbb-arguo-module-hpw.asc
Q11 N056 N035 N033 0 CA_BC560C
R2 N072 N074 100
R3 N073 N074 100
R9 N026 N033 220
R10 N026 N034 220
R16 N001 N003 51
Q12 N010 N009 N003 0 2SA1381F
R27 N022 N021 10
R30 N050 N045 10
R47 N001 N005 100
R§PBIAS1 N027 N038 {1+(500*BIAS)}
R52 N020 N027 1k5
R53 N021 N020 18
Q3 N066 N068 N070 0 2SC3503F
R6 N070 N074 24
R4 N014 lgnd 5k1
Q1 N026 N008 N005 0 2SA1381F
Q7 N061 N036 N034 0 CA_BC560C
Q21 N021 N027 N045 0 MJE340
R37 N038 N045 510
Q4 N019 N025 N031 0 MJL3281A
Q9 N053 N048 N040 0 MJL1302A
R5 N025 N024 2.7
R68 N048 N046 2.7
Cmc N044 N043 100p V=100 Irms=20.8m Rser=5.448 Lser=3n Rpar=6.4meg Cpar=1p
Q6 N065 N065 N073 0 CA_BC550C
Q8 N042 N065 N072 0 CA_BC550C
R15 N003 N002 1k
Q2 lgnd N042 N068 0 BC546B
R7 N068 N074 680
Ctc N045 N044 1n V=100 Irms=75.3m Rser=2.89088 Lser=3n Rpar=4.4meg Cpar=1p
Rtc N037 N044 1k
D1 N042 N066 BAV21
Q10 N009 N002 N001 0 BC556B
R14 N031 N037 0.22
R21 N037 N040 0.22
R35 N008 lgnd 10k
C1 N045 N021 220n V=25 Irms=1.76 Rser=0.057522 Lser=3n Rpar=4.4meg Cpar=1p
L1 gnd lgnd 15n Rser=20m
L2 ninv N035 15n Rser=20m
L3 inv N036 15n Rser=20m
L10 N037 out 20n Rser=10m
L9 N016 pvcc 10n Rser=10m
L12 N060 pvee 10n Rser=10m
C4 N064 N065 22p V=100 Irms=20.8m Rser=15.448 Lser=3n Rpar=6.4meg Cpar=1p
R17 N064 N042 680
Q13 N008 N006 N001 0 BC556B
R12 N006 N005 1k
Q14 N001 N022 N024 0 2SC4793
Q15 N074 N050 N046 0 2SA1837
R1 N024 N046 56
Q5 N042 N069 N074 0 2N5550
R19 N070 N069 1k
Cpsrgs N072 N074 100p V=100 Irms=20.8m Rser=5.448 Lser=3n Rpar=6.4meg Cpar=1p
Cpsrg lgnd N073 100p V=100 Irms=20.8m Rser=5.448 Lser=3n Rpar=6.4meg Cpar=1p
Q16 N029 N030 N037 0 BC546B
D2 N021 N029 BAV21
R11 N030 N037 1k
R13 N031 N030 1k
Q17 N049 N039 N037 0 BC556B
R18 N037 N039 1k
R20 N040 N039 1k
D3 N049 N045 BAV21
R22 N031 N037 0.22
R23 N037 N040 0.22
Rrhz N043 N042 1e-3
R25 N032 N037 0.22
R26 N037 N041 0.22
R28 N032 N037 0.22
R29 N037 N041 0.22
Q18 N019 N028 N032 0 MJL3281A
R31 N028 N024 2.7
Q19 N053 N047 N041 0 MJL1302A
R32 N047 N046 2.7
L4 N001 phvcc 10n Rser=10m
D4 N016 N019 MBR20100CT
R34 N023 lgnd 1
C3 N023 N019 220n V=25 Irms=1.76 Rser=0.057522 Lser=3n Rpar=4.4meg Cpar=1p
D5 N053 N060 MBR20100CT
R36 N051 N053 1
C7 N051 lgnd 220n V=25 Irms=1.76 Rser=0.057522 Lser=3n Rpar=4.4meg Cpar=1p
Q20 N042 N057 N056 0 2SA1381F
Q22 N065 N062 N061 0 2SA1381F
D6 N052 lgnd BZX84C15VL
R8 N052 N074 10k
R38 N001 N007 51
Q23 N010 N009 N007 0 2SA1381F
R39 N007 N002 1k
Q24 N066 N068 N071 0 2SC3503F
R40 N071 N074 24
R41 N069 N071 1k
C5 N052 lgnd 220n V=25 Irms=1.76 Rser=0.057522 Lser=3n Rpar=4.4meg Cpar=1p
R42 N052 N057 100
R43 N052 N062 100
R46 N004 lgnd 1
C8 N004 N001 220n V=25 Irms=1.76 Rser=0.057522 Lser=3n Rpar=4.4meg Cpar=1p
R61 N075 lgnd 1
C9 N075 N074 220n V=25 Irms=1.76 Rser=0.057522 Lser=3n Rpar=4.4meg Cpar=1p
L5 N074 phvee 10n Rser=10m
D8 N020 N010 1N750
D7 N066 N045 1N750
Q25 N001 N011 N012 0 2SC4793
Q26 N001 N013 N017 0 MJL3281A
R24 N013 N012 2.7
Q27 N001 N015 N018 0 MJL3281A
R33 N015 N012 2.7
R44 N017 N019 0.22
R45 N017 N019 0.22
R48 N018 N019 0.22
R49 N018 N019 0.22
R50 N012 N019 100
R51 N053 N054 0.22
R54 N053 N054 0.22
R55 N053 N055 0.22
R56 N053 N055 0.22
Q28 N074 N063 N054 0 MJL1302A
R57 N063 N058 2.7
Q29 N074 N067 N058 0 2SA1837
Q30 N074 N059 N055 0 MJL1302A
R58 N059 N058 2.7
D10 N010 N011 BAV21
D11 N067 N066 BAV21
R59 N053 N058 100
D12 N010 N009 BAV21
R60 N009 N014 5k1
C2 N014 N001 22µ V=25 Irms=1.76 Rser=0.057522 Lser=3n Rpar=4.4meg Cpar=1p
.model D D
.lib standard.dio
.model NPN NPN
.model PNP PNP
.lib standard.bjt
.lib ../../spice_root/lib/ONNN_BJT.lib
.lib ../../spice_root/lib/STM_D.lib
.lib ../../spice_root/lib/FCS_BJT.lib
.lib ../../spice_root/lib/FCS_D.lib
.lib ../../spice_root/lib/ONNN_D.lib
.lib ../../spice_root/lib/TSE_BJT.lib
.lib ../../spice_root/lib/TXN_IC.lib
.backanno
.end